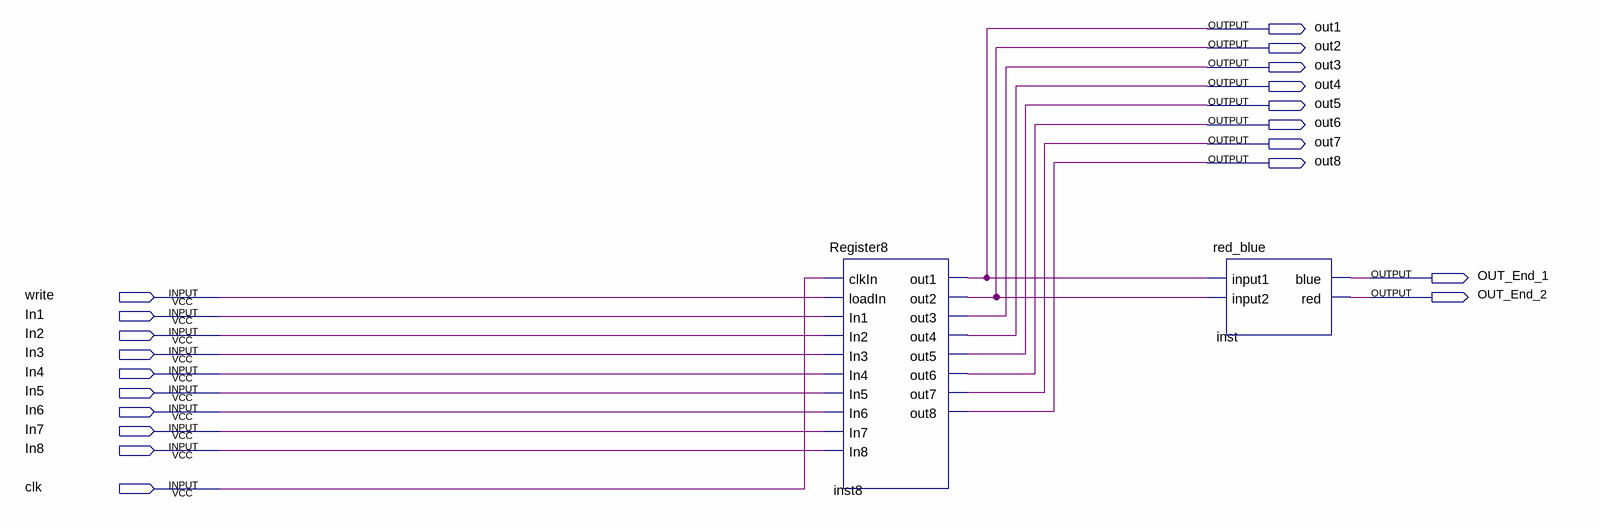
[diagram p0: schematic sheet]
// Quartus schematic OUTPUT_end.bdf as structural Verilog: 2 symbols, 20 pins
module OUTPUT_end (
  input  write,
  input  In1,
  input  In2,
  input  In3,
  input  In4,
  input  In5,
  input  In6,
  input  In7,
  input  In8,
  input  clk,
  output out1,
  output out2,
  output out3,
  output out4,
  output out5,
  output out6,
  output out7,
  output out8,
  output OUT_End_1,
  output OUT_End_2
);

  Register8 inst8 (
    .clkIn(clk), .loadIn(write), .In1(In1), .In2(In2), .In3(In3), .In4(In4), .In5(In5), .In6(In6), .In7(In7),
    .In8(In8), .out1(out1), .out2(out2), .out3(out3), .out4(out4), .out5(out5), .out6(out6), .out7(out7),
    .out8(out8));
  red_blue inst (.input1(out1), .input2(out2), .blue(OUT_End_1), .red(OUT_End_2));
endmodule
